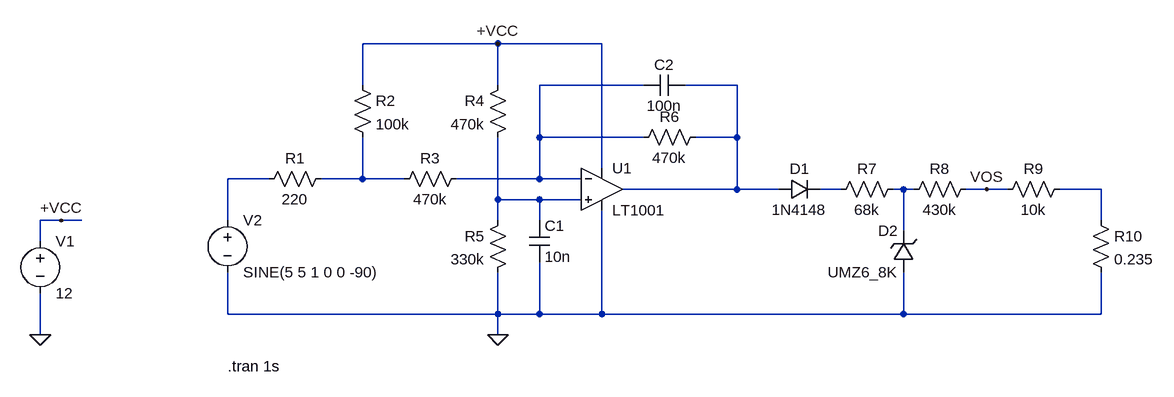
[diagram p0: schematic DimmingInterface.asc]
DimmingInterface.asc, the LTspice schematic file:
Version 4
SHEET 1 1528 680
WIRE 512 0 304 0
WIRE 672 0 512 0
WIRE 304 64 304 0
WIRE 512 64 512 0
WIRE 736 64 576 64
WIRE 880 64 800 64
WIRE 576 144 576 64
WIRE 736 144 576 144
WIRE 880 144 880 64
WIRE 880 144 816 144
WIRE 672 192 672 0
WIRE 160 208 96 208
WIRE 304 208 304 144
WIRE 304 208 240 208
WIRE 368 208 304 208
WIRE 576 208 576 144
WIRE 576 208 448 208
WIRE 640 208 576 208
WIRE 880 224 880 144
WIRE 880 224 704 224
WIRE 944 224 880 224
WIRE 1040 224 1008 224
WIRE 1136 224 1120 224
WIRE 1152 224 1136 224
WIRE 1264 224 1232 224
WIRE 1296 224 1264 224
WIRE 1440 224 1376 224
WIRE 512 240 512 144
WIRE 576 240 512 240
WIRE 640 240 576 240
WIRE -160 272 -192 272
WIRE -128 272 -160 272
WIRE 96 272 96 208
WIRE 512 272 512 240
WIRE 576 272 576 240
WIRE 1440 272 1440 224
WIRE 1136 288 1136 224
WIRE -192 304 -192 272
WIRE 96 416 96 352
WIRE 512 416 512 352
WIRE 512 416 96 416
WIRE 576 416 576 336
WIRE 576 416 512 416
WIRE 672 416 672 256
WIRE 672 416 576 416
WIRE 1136 416 1136 352
WIRE 1136 416 672 416
WIRE 1440 416 1440 352
WIRE 1440 416 1136 416
WIRE -192 448 -192 384
WIRE 512 448 512 416
FLAG 512 0 +VCC
FLAG 512 448 0
FLAG -192 448 0
FLAG -160 272 +VCC
FLAG 1264 224 VOS
SYMBOL res 256 192 R90
WINDOW 0 0 56 VBottom 2
WINDOW 3 32 56 VTop 2
SYMATTR InstName R1
SYMATTR Value 220
SYMBOL res 288 48 R0
SYMATTR InstName R2
SYMATTR Value 100k
SYMBOL res 464 192 R90
WINDOW 0 0 56 VBottom 2
WINDOW 3 32 56 VTop 2
SYMATTR InstName R3
SYMATTR Value 470k
SYMBOL res 528 48 M0
SYMATTR InstName R4
SYMATTR Value 470k
SYMBOL res 528 256 M0
SYMATTR InstName R5
SYMATTR Value 330k
SYMBOL cap 560 272 R0
SYMATTR InstName C1
SYMATTR Value 10n
SYMBOL Opamps/LT1001 672 160 R0
SYMATTR InstName U1
SYMBOL res 832 128 R90
WINDOW 0 0 56 VBottom 2
WINDOW 3 32 56 VTop 2
SYMATTR InstName R6
SYMATTR Value 470k
SYMBOL cap 736 48 M90
WINDOW 0 0 32 VBottom 2
WINDOW 3 32 32 VTop 2
SYMATTR InstName C2
SYMATTR Value 100n
SYMBOL diode 944 240 R270
WINDOW 0 32 32 VTop 2
WINDOW 3 0 32 VBottom 2
SYMATTR InstName D1
SYMATTR Value 1N4148
SYMBOL res 1136 208 R90
WINDOW 0 0 56 VBottom 2
WINDOW 3 32 56 VTop 2
SYMATTR InstName R7
SYMATTR Value 68k
SYMBOL res 1248 208 R90
WINDOW 0 0 56 VBottom 2
WINDOW 3 32 56 VTop 2
SYMATTR InstName R8
SYMATTR Value 430k
SYMBOL zener 1152 352 R180
WINDOW 0 24 64 Left 2
WINDOW 3 24 0 Left 2
SYMATTR InstName D2
SYMATTR Value UMZ6_8K
SYMBOL voltage -192 288 R0
SYMATTR InstName V1
SYMATTR Value 12
SYMBOL voltage 96 256 R0
SYMATTR InstName V2
SYMATTR Value SINE(5 5 1 0 0 -90)
SYMBOL res 1392 208 R90
WINDOW 0 0 56 VBottom 2
WINDOW 3 32 56 VTop 2
SYMATTR InstName R9
SYMATTR Value 10k
SYMBOL res 1424 256 R0
SYMATTR InstName R10
SYMATTR Value 0.235
TEXT 96 496 Left 2 !.tran 1s

The netlist it stands for:
* DimmingInterface.asc
R1 N004 N003 220
R2 +VCC N004 100k
R3 N001 N004 470k
R4 +VCC N008 470k
R5 N008 0 330k
C1 N008 0 10n
XU1 N008 N001 +VCC 0 N002 LT1001  ; pins In+ In- V+ V- OUT
R6 N002 N001 470k
C2 N001 N002 100n
D1 N002 N005 1N4148
R7 N006 N005 68k
R8 VOS N006 430k
D2 0 N006 UMZ6_8K
V1 +VCC 0 12
V2 N003 0 SINE(5 5 1 0 0 -90)
R9 N007 VOS 10k
R10 N007 0 0.235
.model D D
.lib standard.dio
.tran 1s
.lib LTC.lib
.backanno
.end